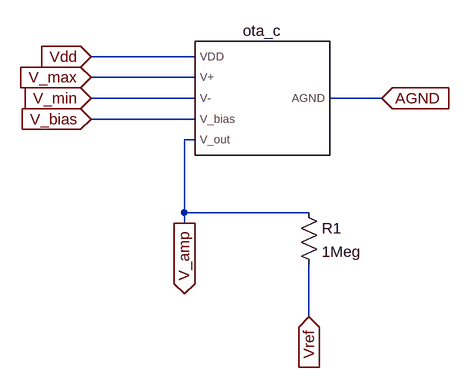
[diagram p0: schematic qrs_amp.asc]
qrs_amp.asc, the LTspice schematic file:
Version 4.1
SHEET 1 880 680
WIRE 96 112 -64 112
WIRE 96 144 -64 144
WIRE 96 176 -64 176
WIRE 384 176 304 176
WIRE 96 208 -64 208
WIRE 96 240 80 240
WIRE 80 352 80 240
WIRE 272 352 80 352
WIRE 80 368 80 352
WIRE 272 512 272 432
FLAG -64 144 V_max
IOPIN -64 144 In
FLAG -64 176 V_min
IOPIN -64 176 In
FLAG 80 368 V_amp
IOPIN 80 368 Out
FLAG -64 112 Vdd
IOPIN -64 112 In
FLAG -64 208 V_bias
IOPIN -64 208 In
FLAG 384 176 AGND
IOPIN 384 176 In
FLAG 272 512 Vref
IOPIN 272 512 In
SYMBOL ota_core 192 176 R0
SYMATTR InstName ota_c
SYMBOL res 256 336 R0
SYMATTR InstName R1
SYMATTR Value 1Meg

The netlist it stands for:
* qrs_amp.asc
X§ota_c Vdd V_max V_min V_bias V_amp AGND ota_core  ; pins VDD V+ V- V_bias V_out AGND
R1 V_amp Vref 1Meg
.backanno
.end